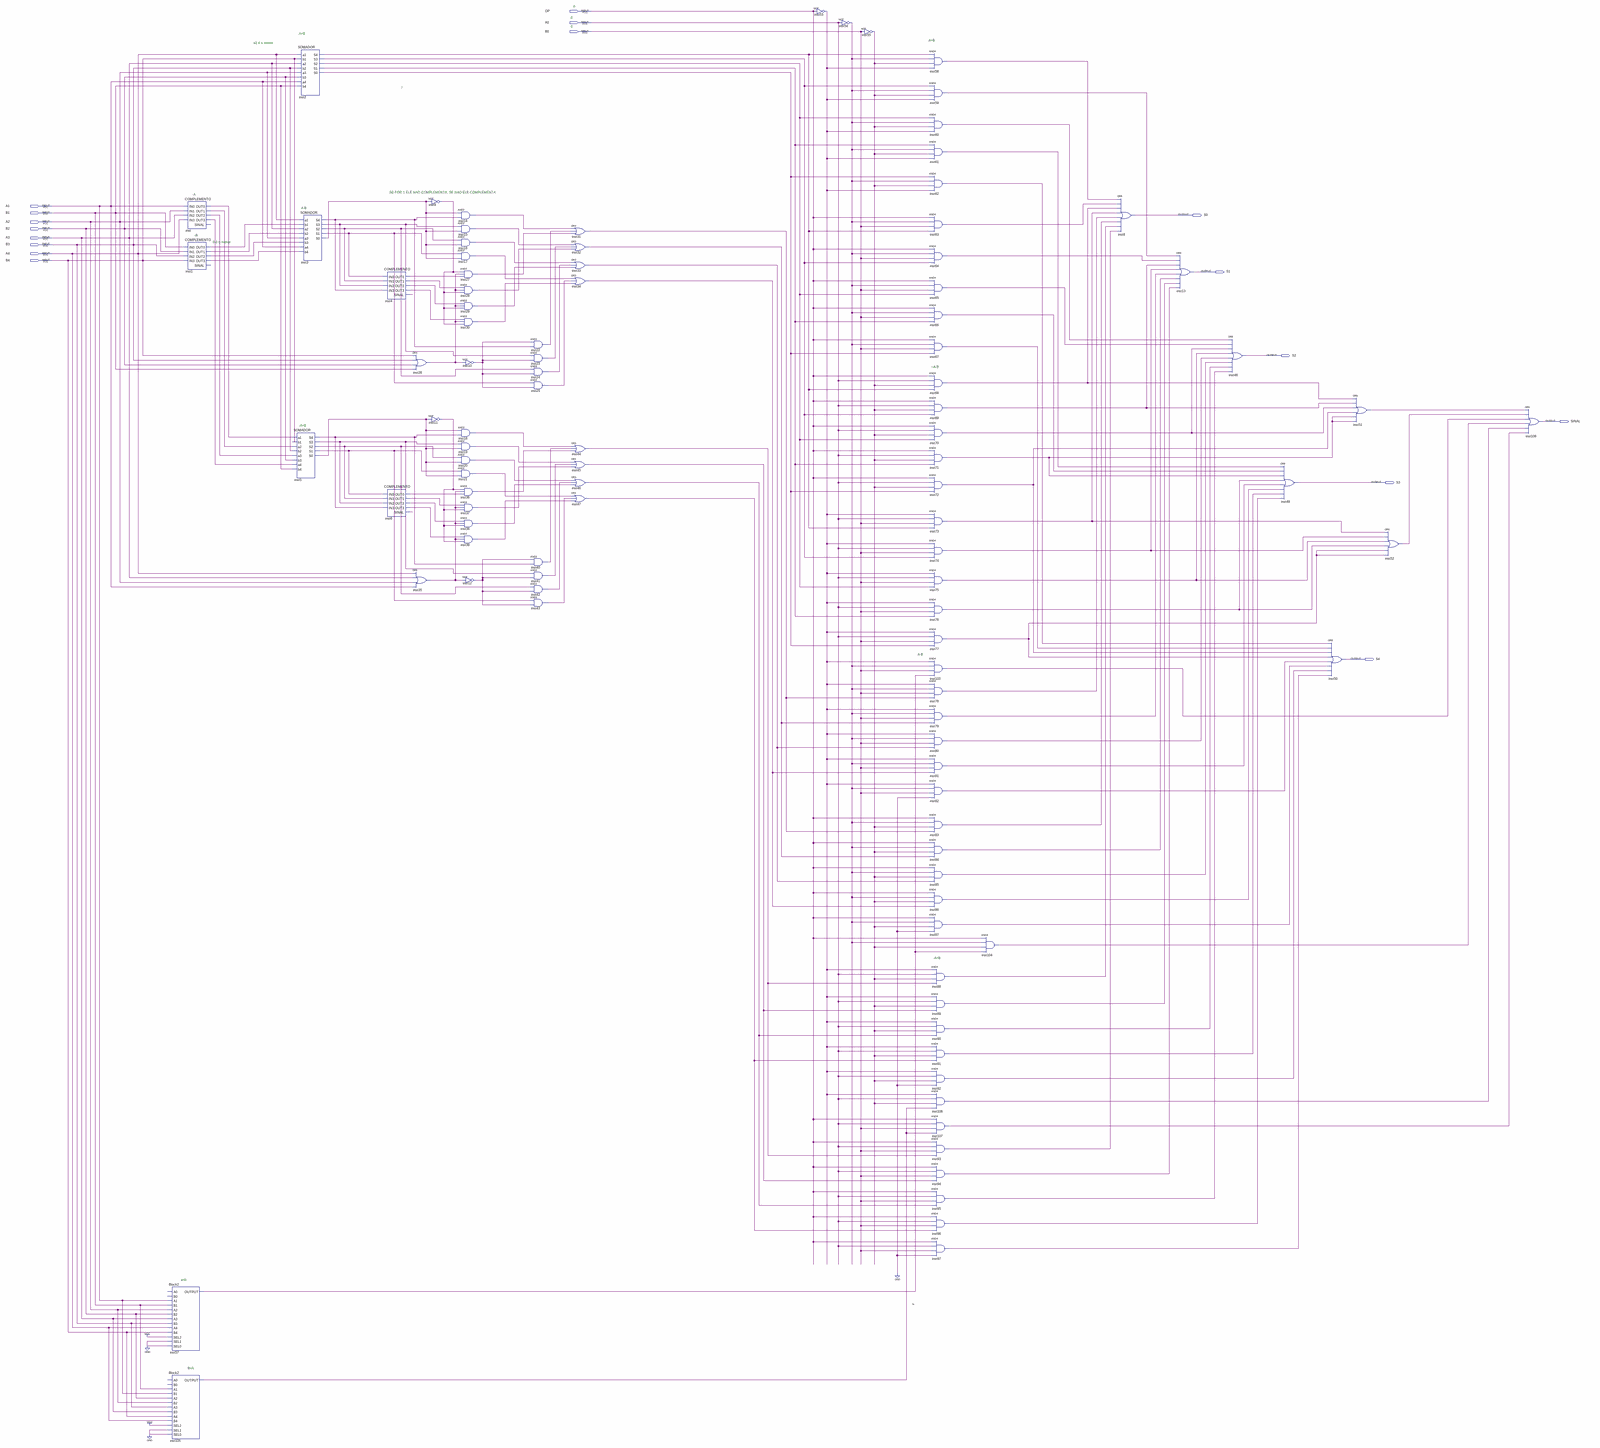
[diagram p0: schematic sheet, whole]
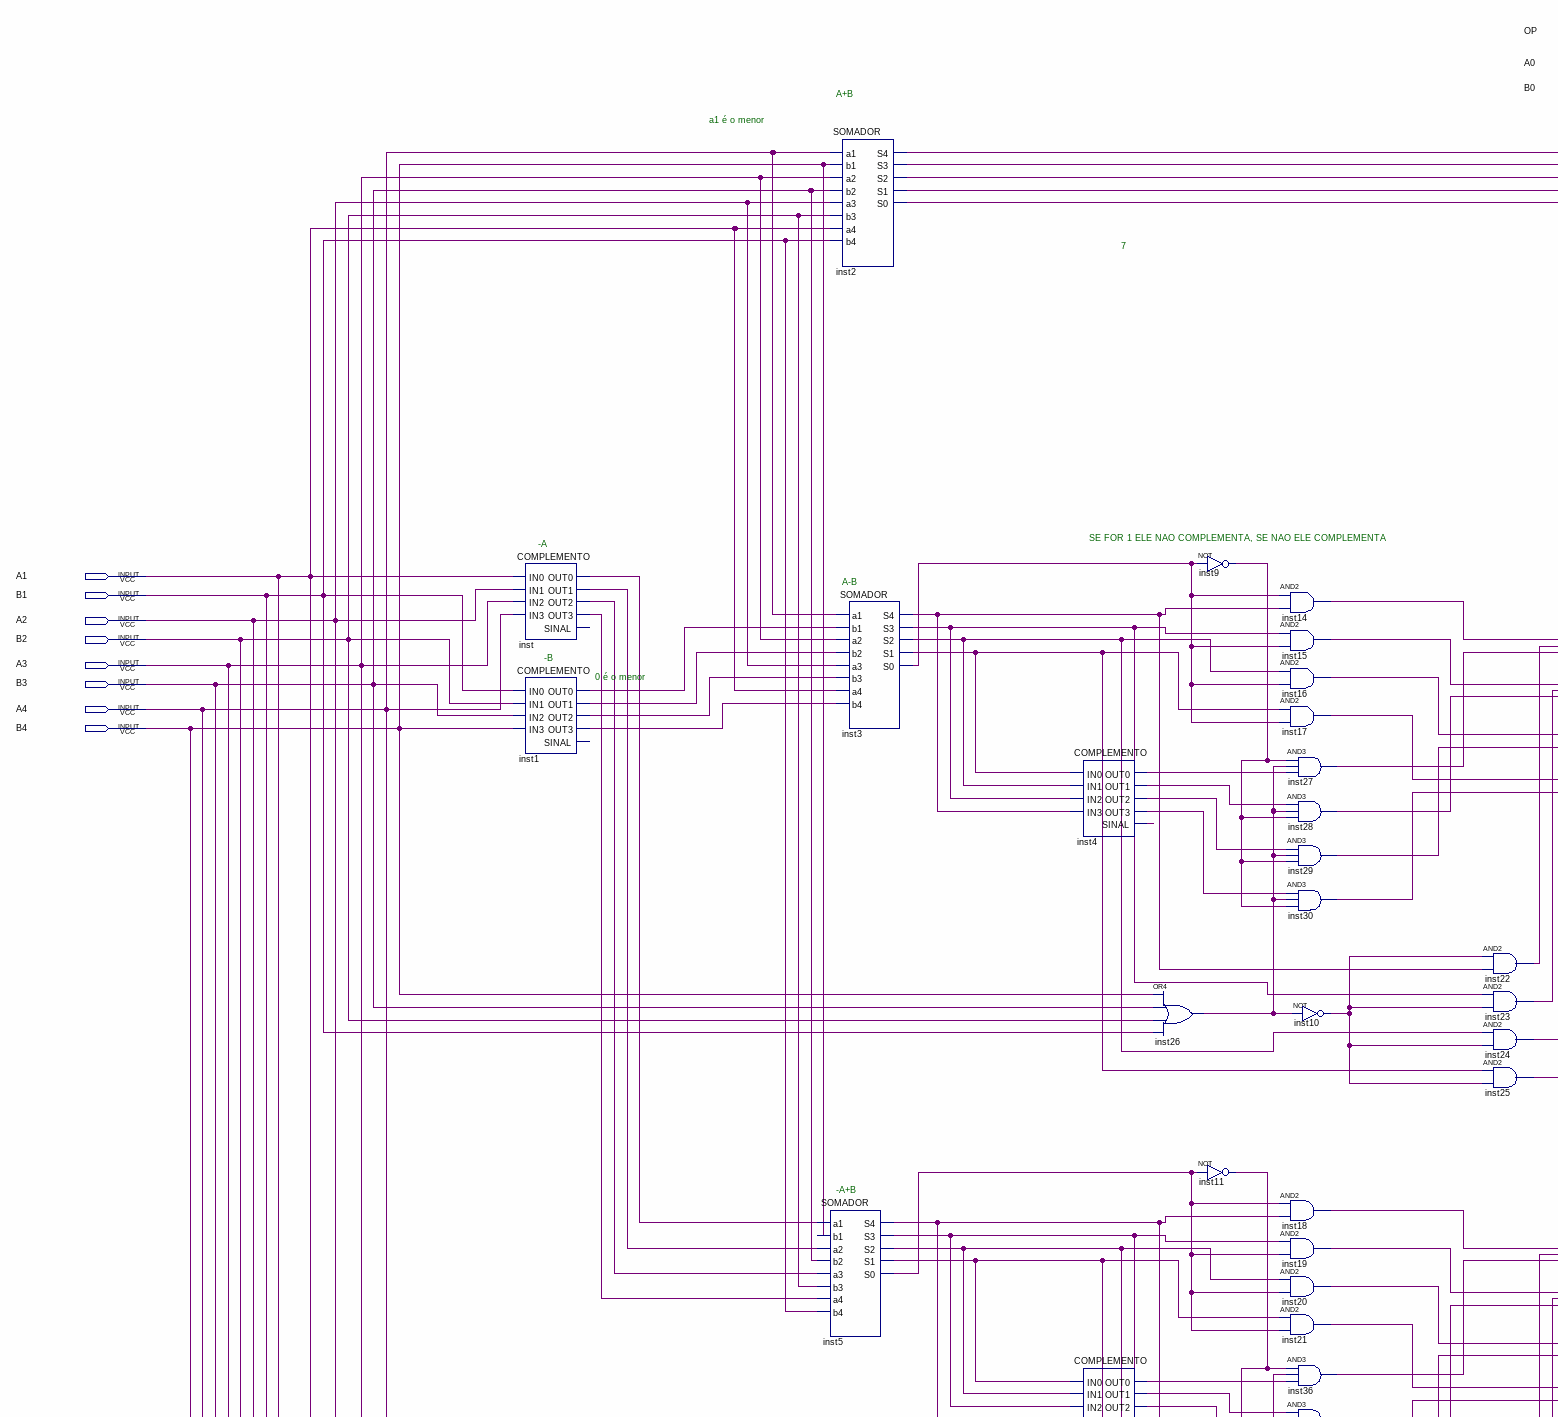
[diagram p1: schematic sheet, upper left part]
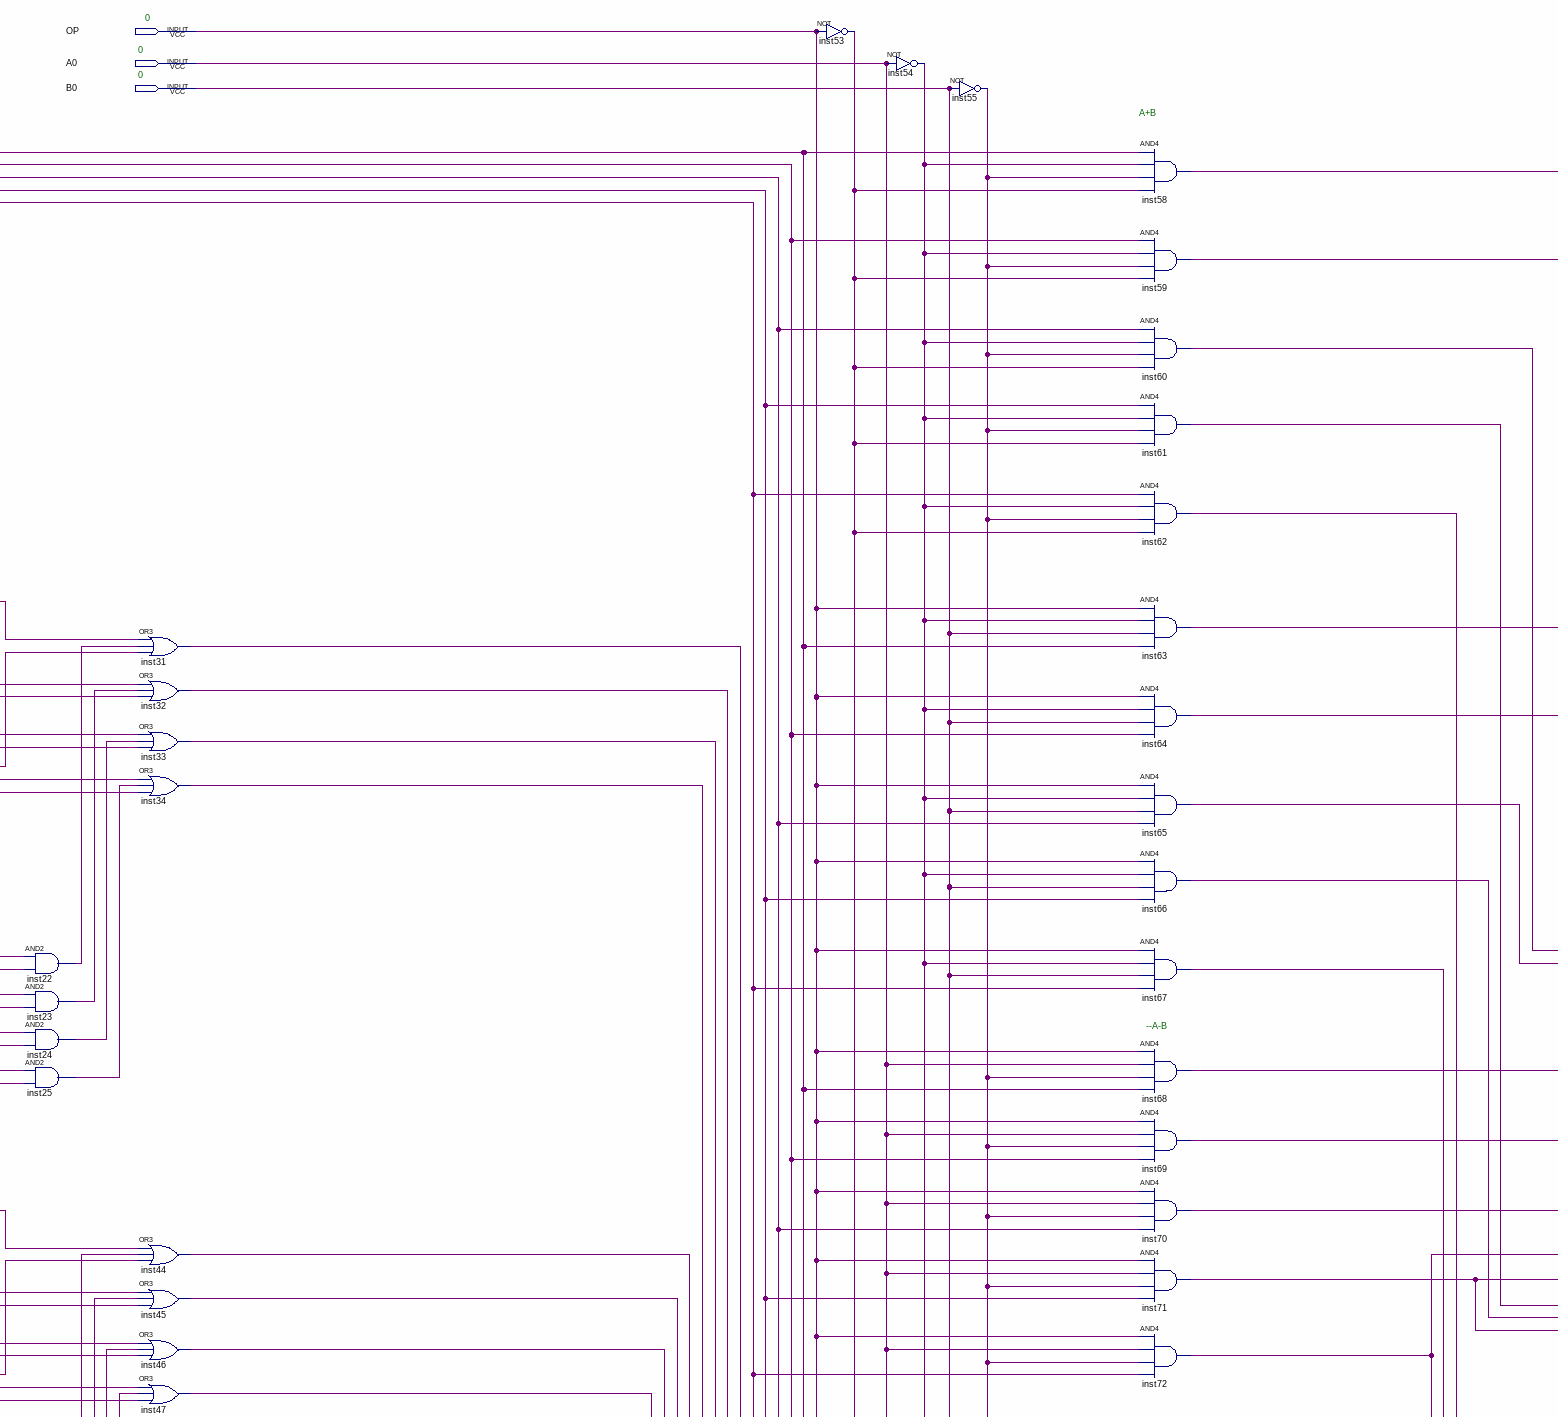
[diagram p2: schematic sheet, upper centre part]
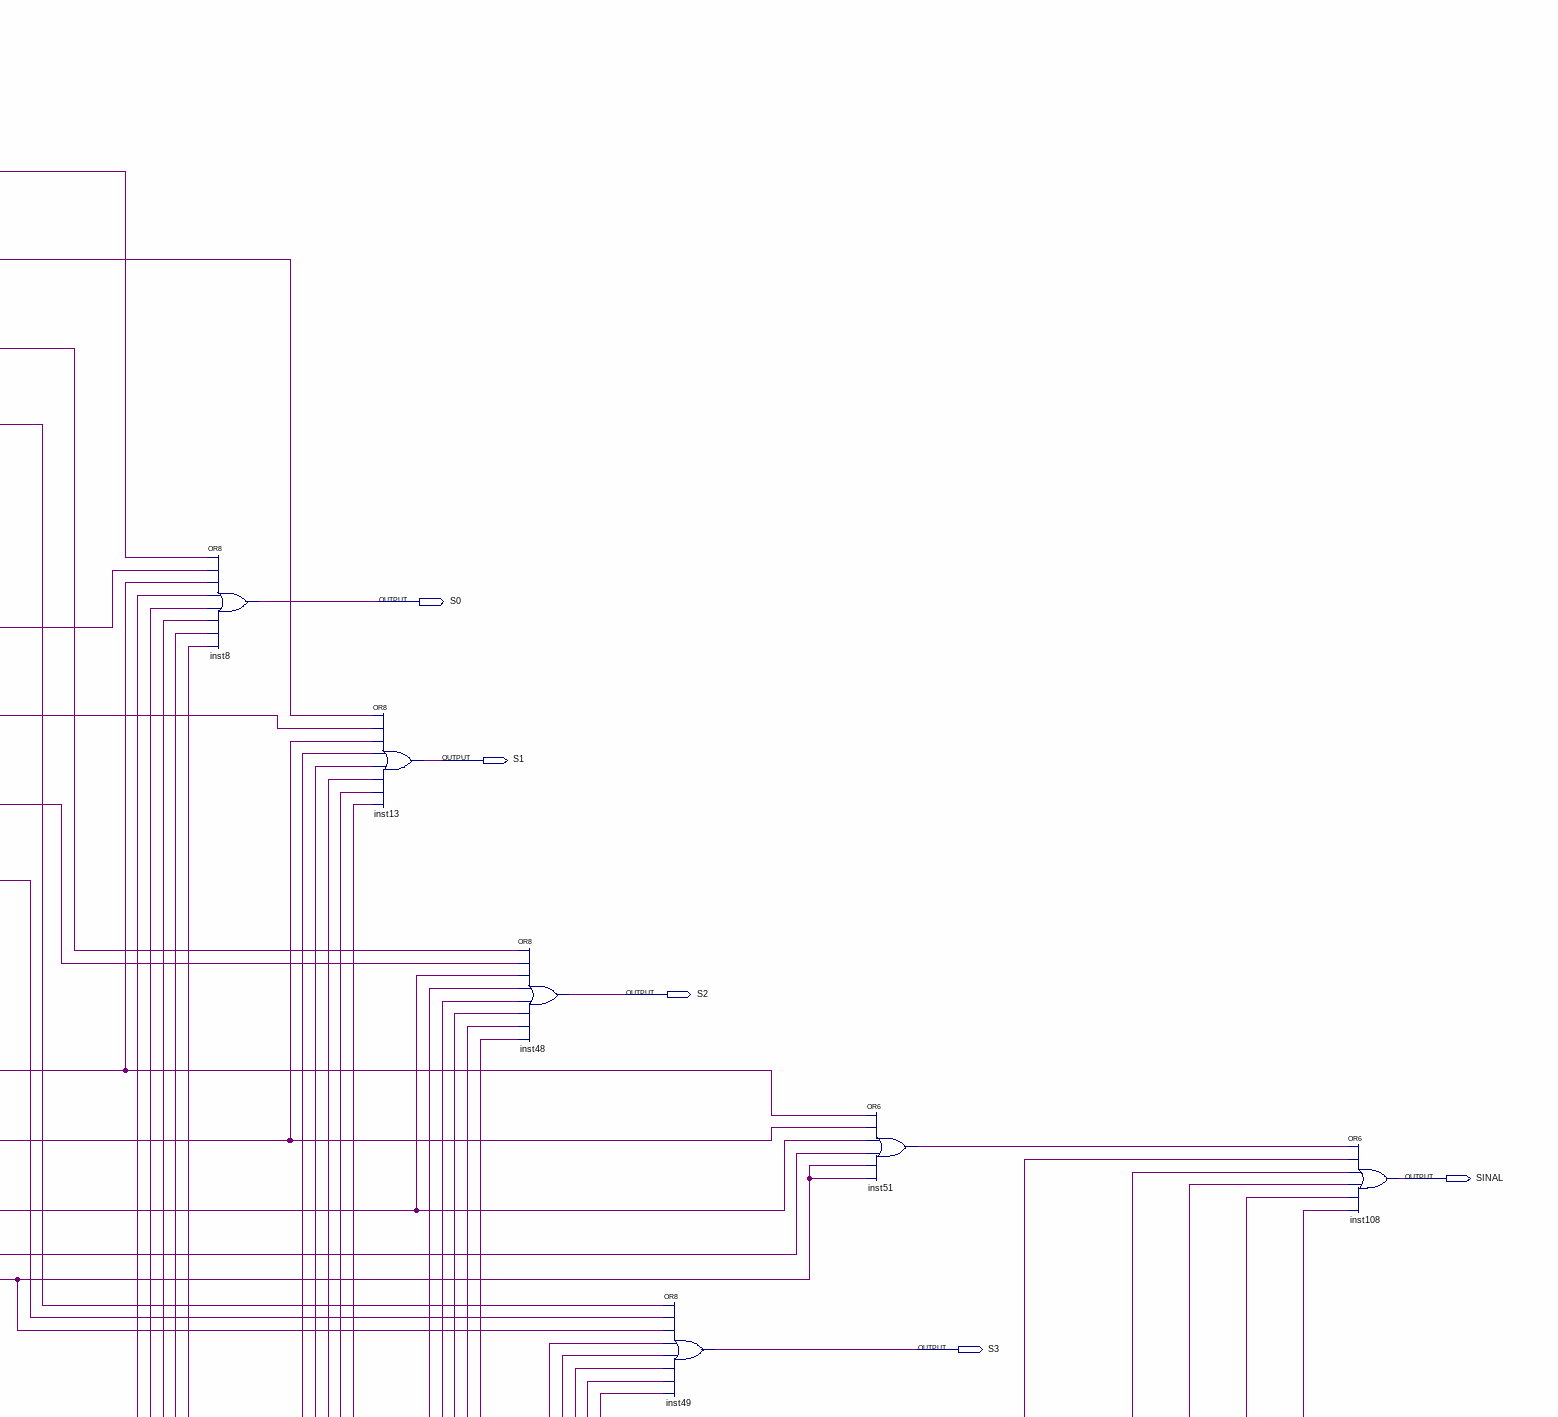
[diagram p3: schematic sheet, upper right part]
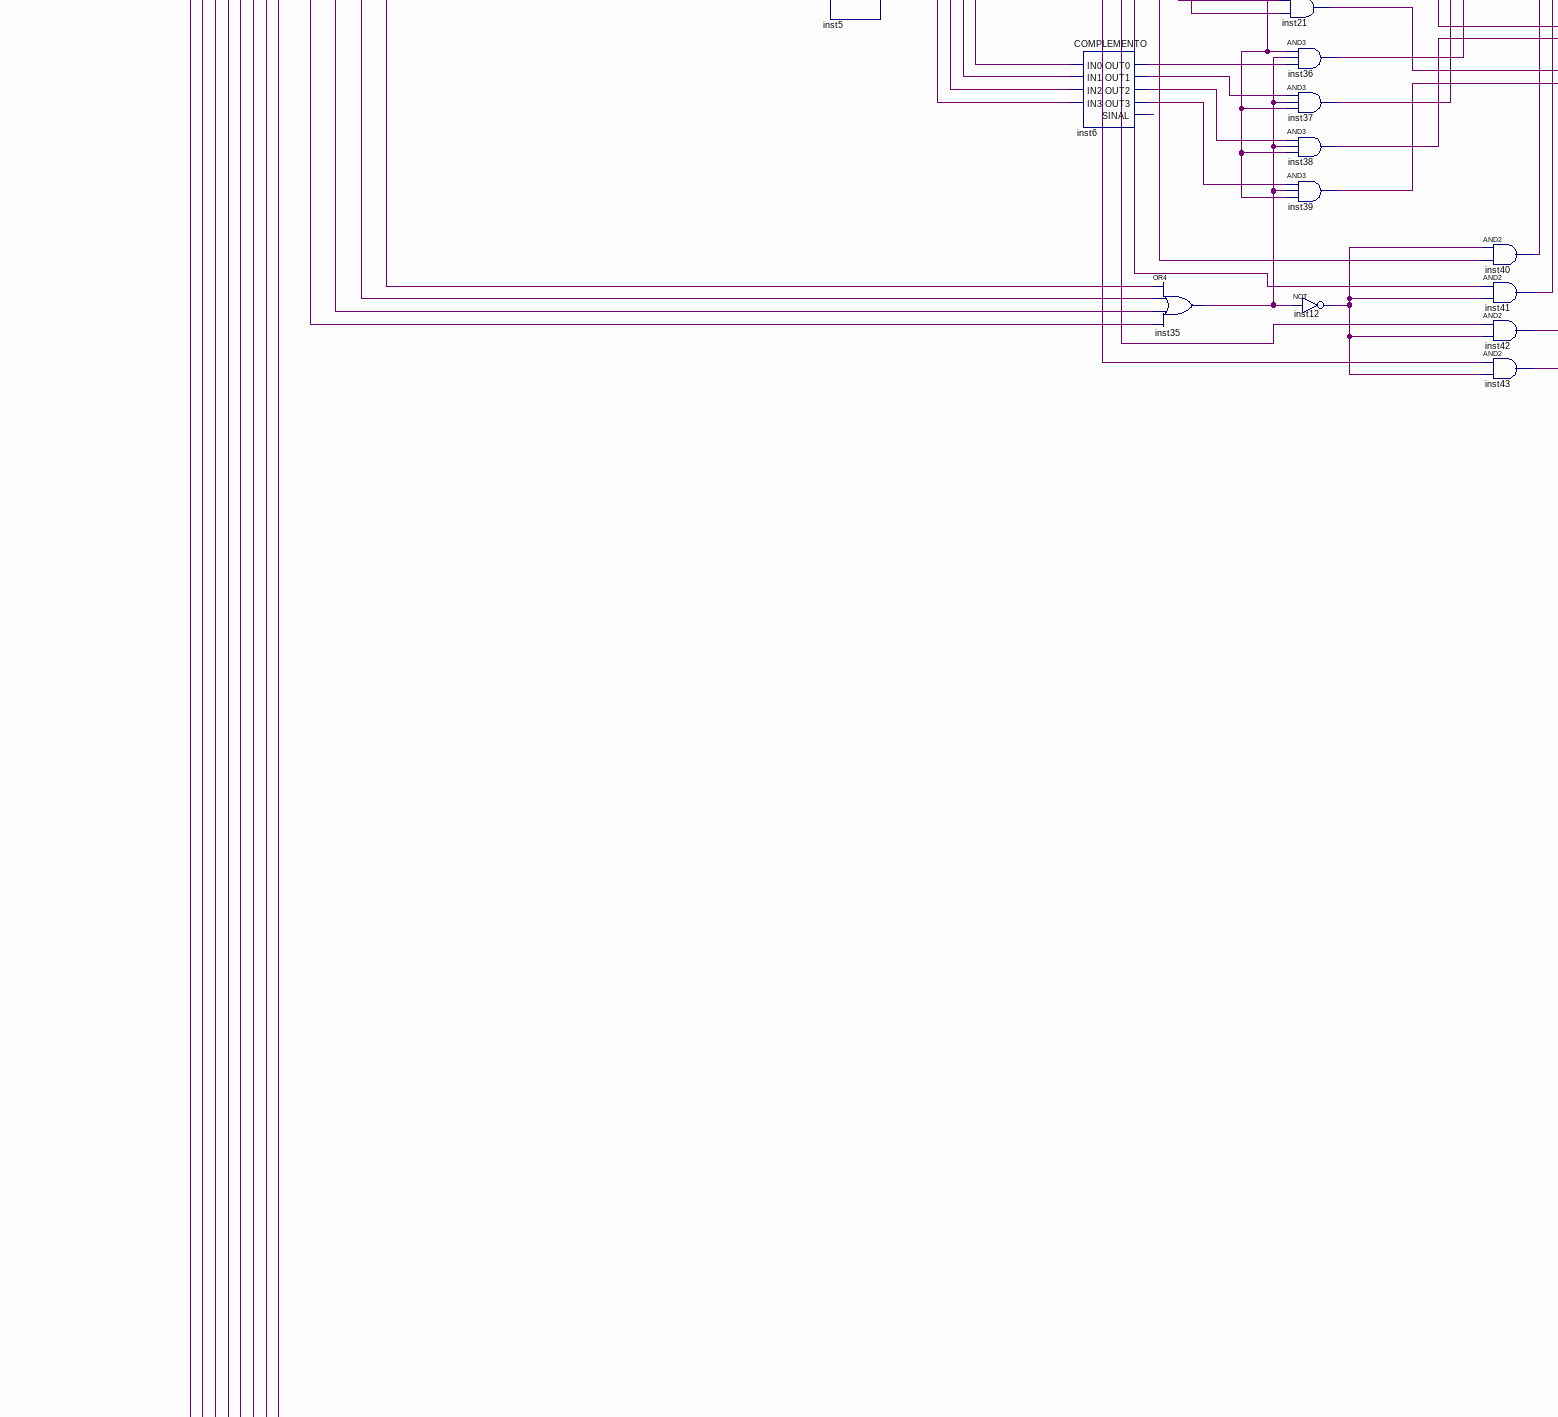
[diagram p4: schematic sheet, middle left part]
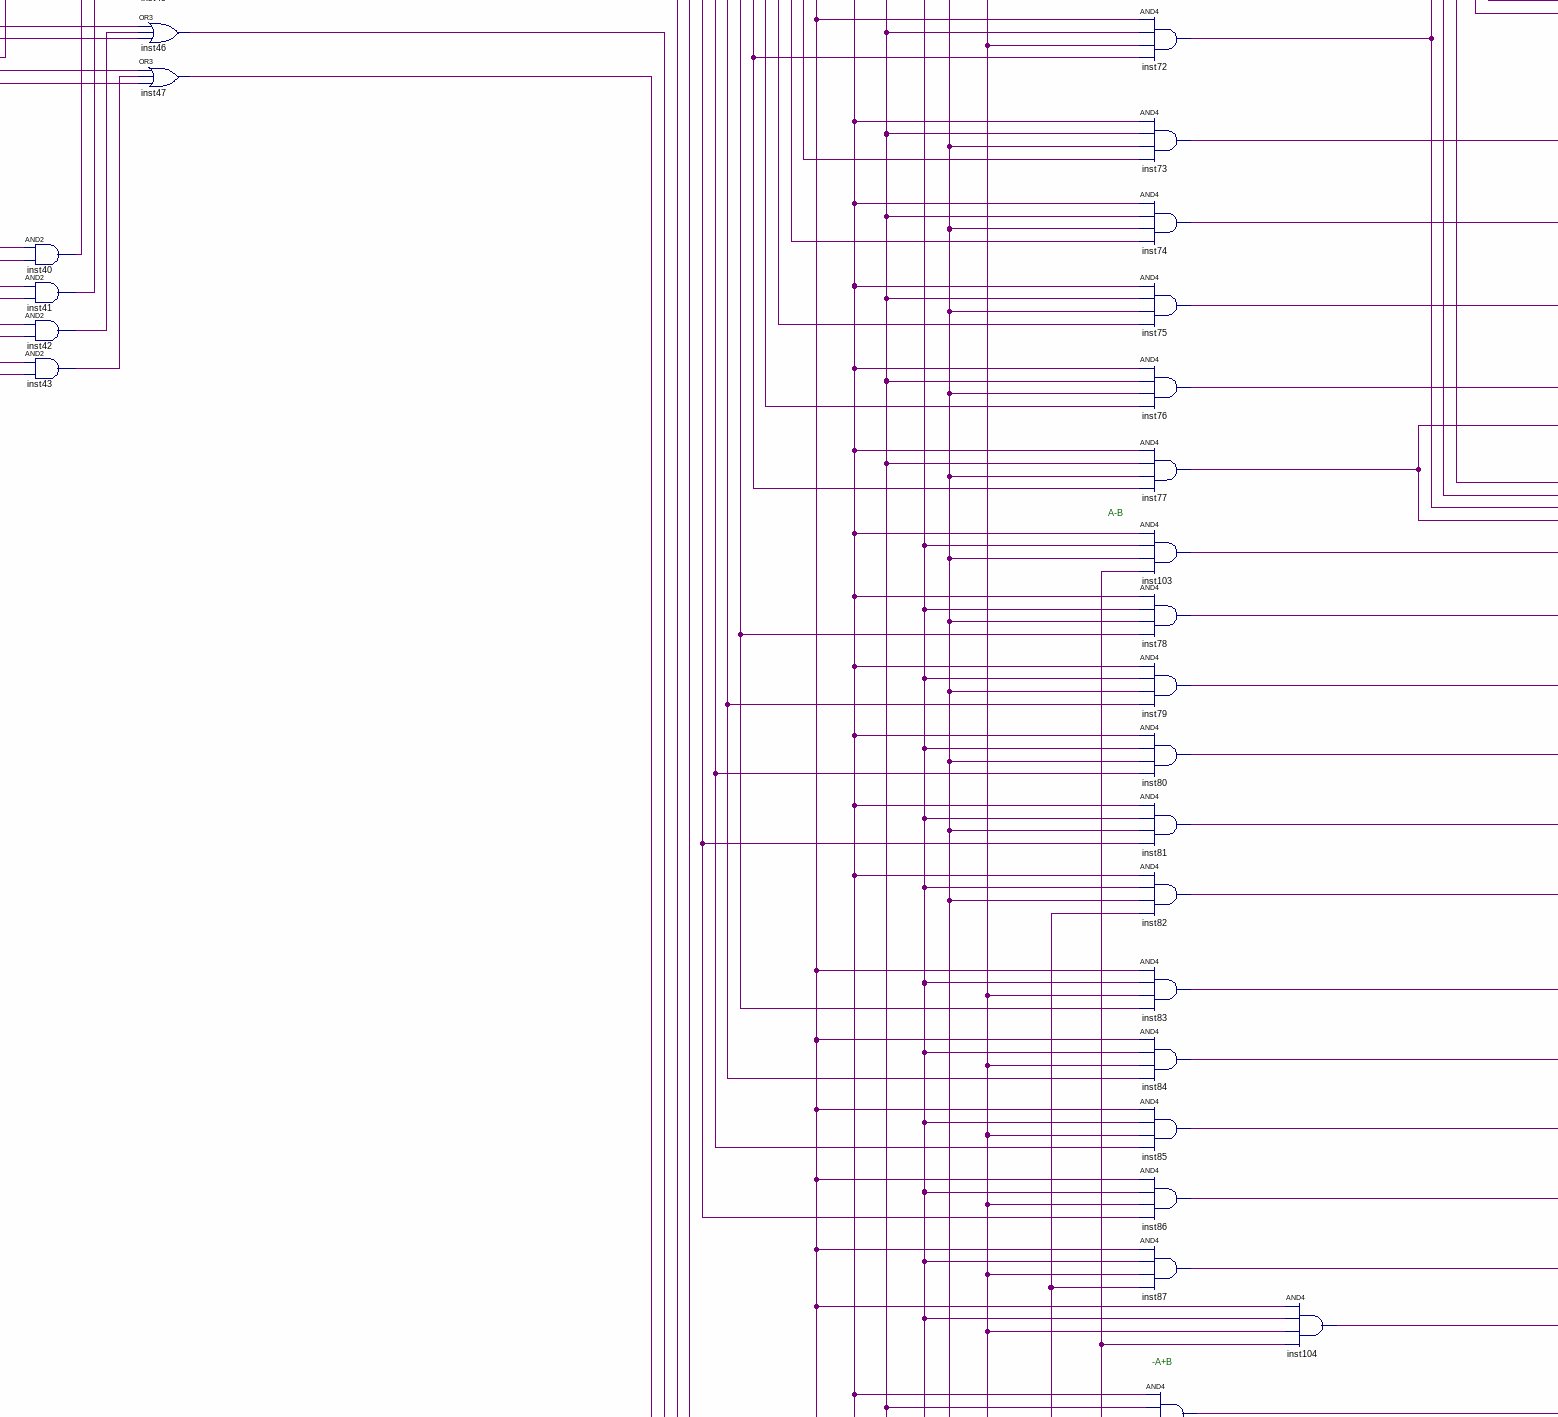
[diagram p5: schematic sheet, middle centre part]
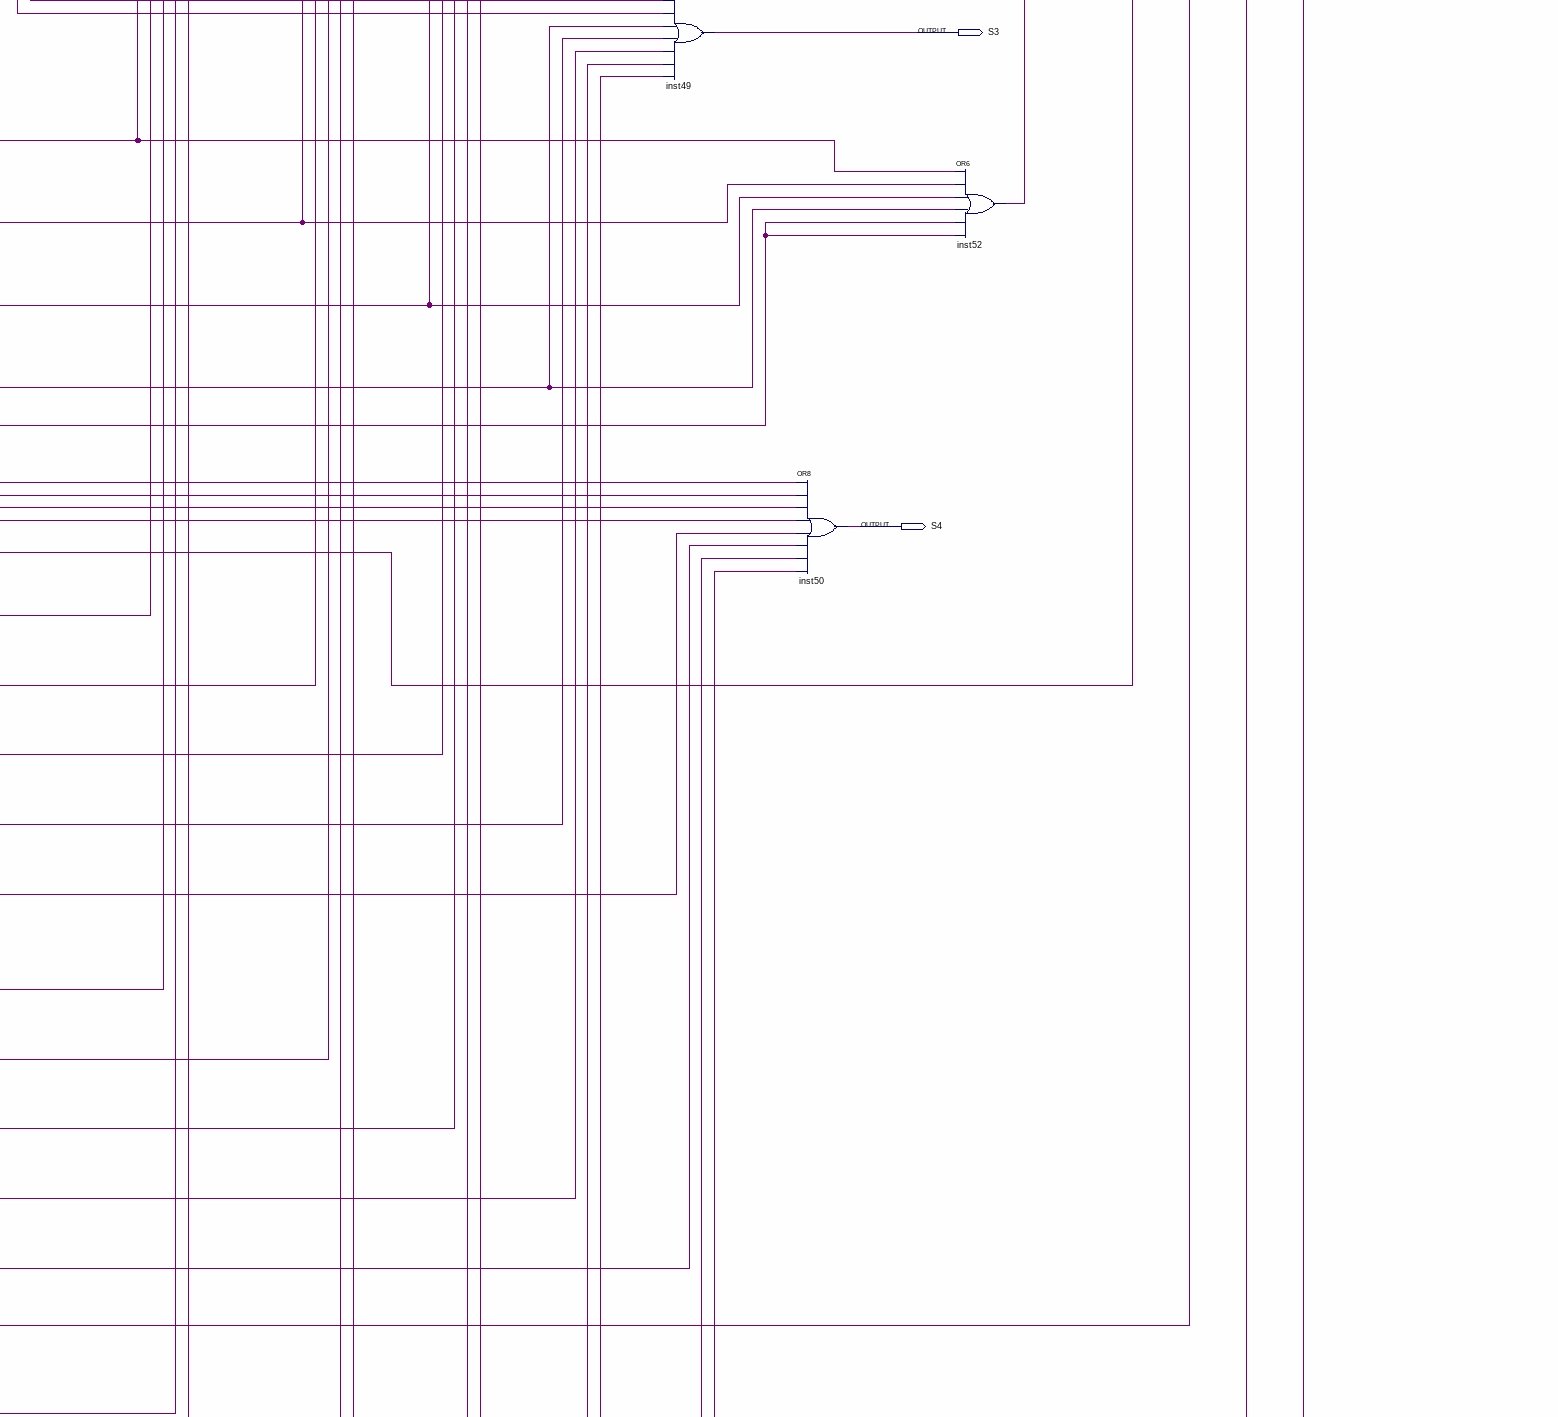
[diagram p6: schematic sheet, middle right part]
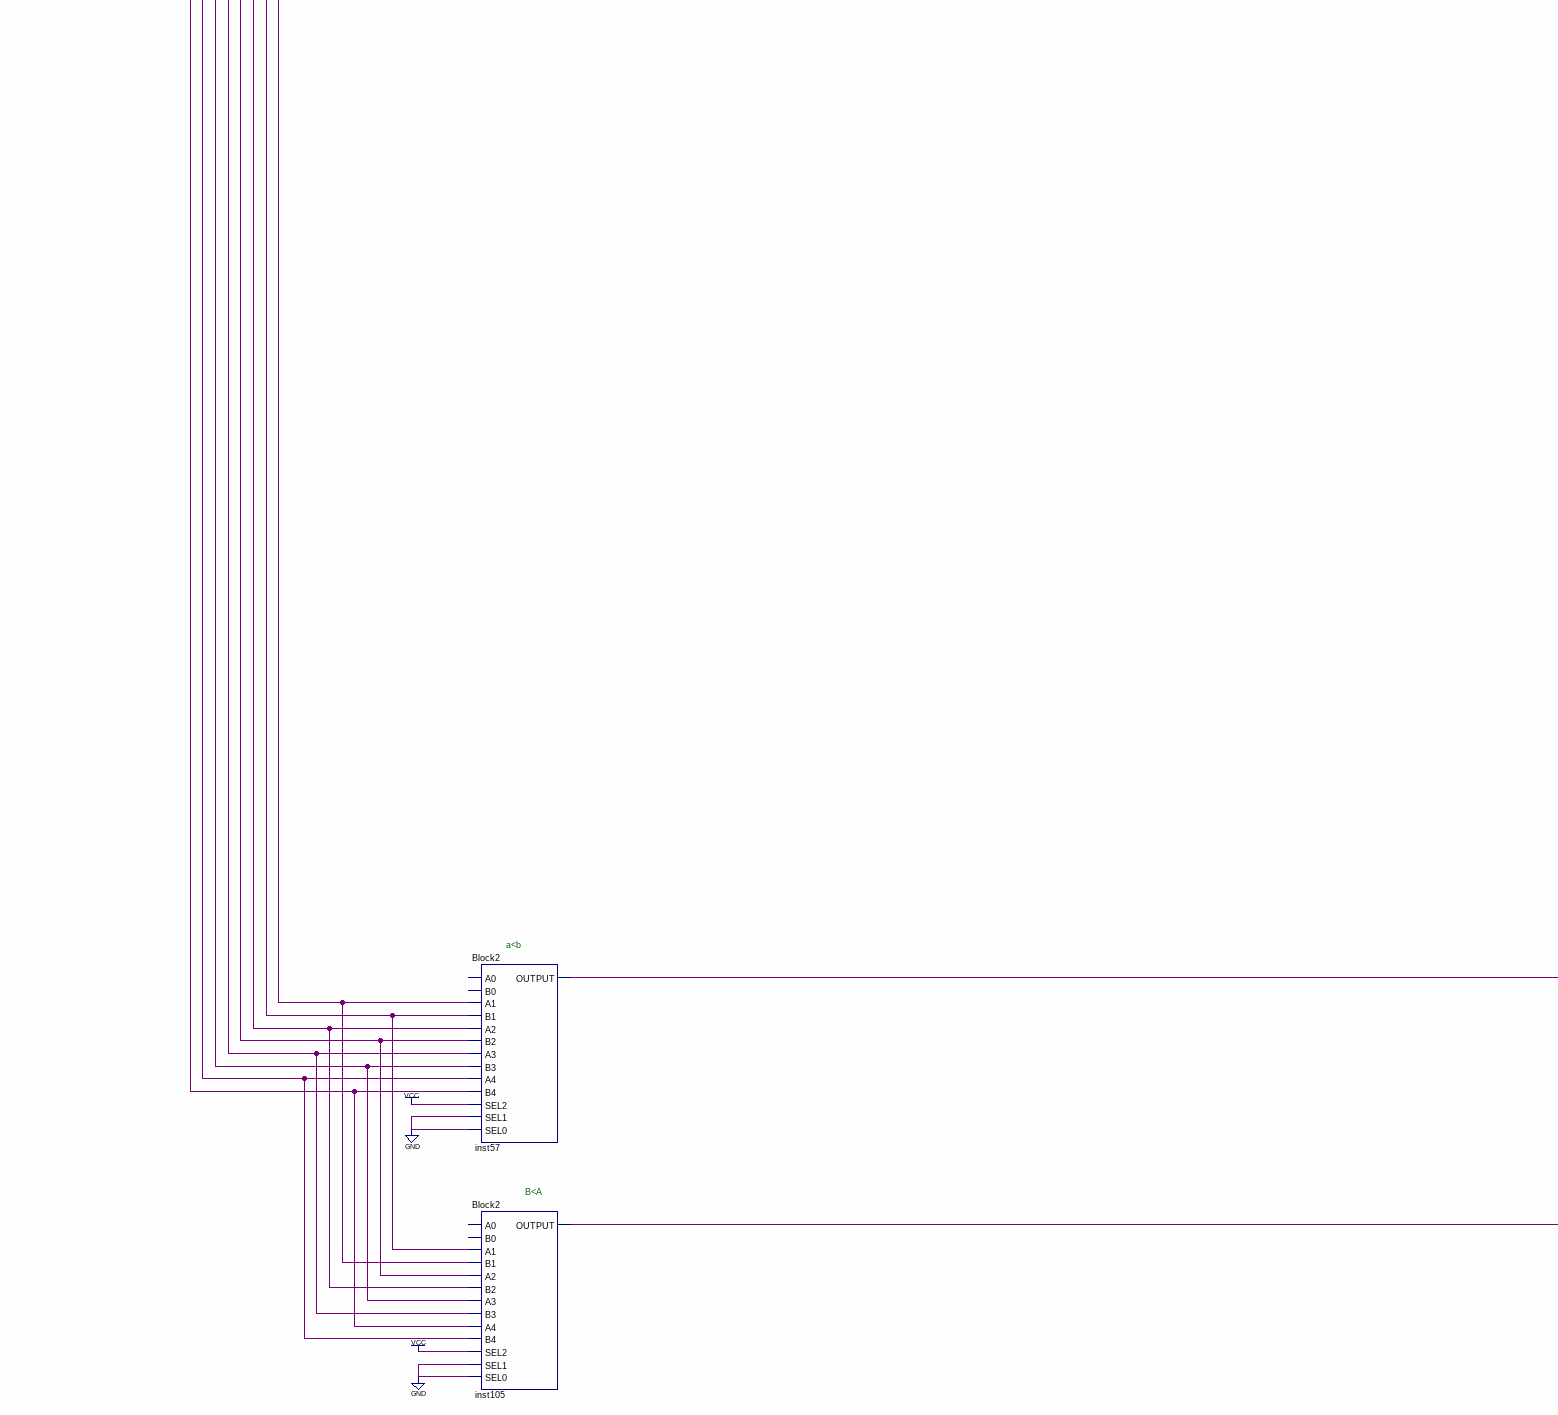
[diagram p7: schematic sheet, lower left part]
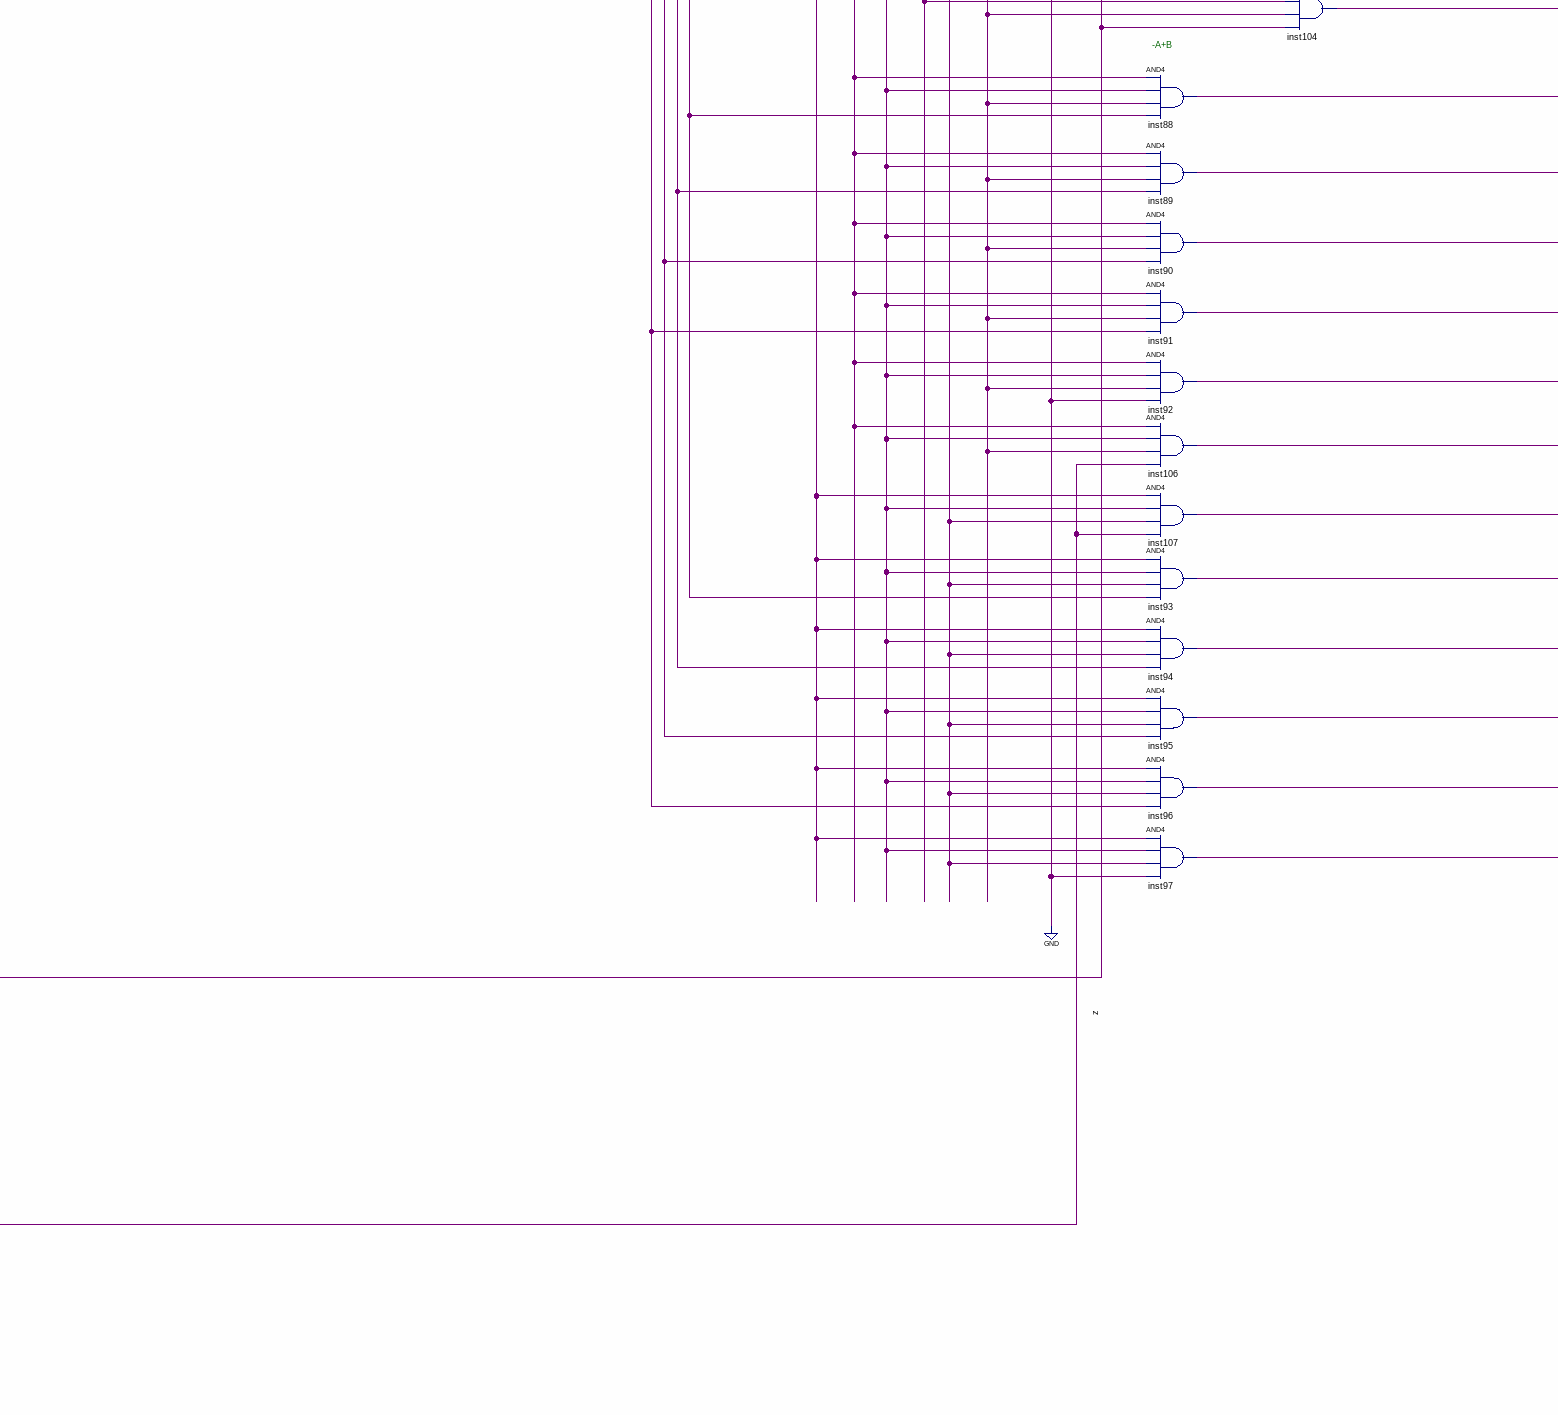
[diagram p8: schematic sheet, lower centre part]
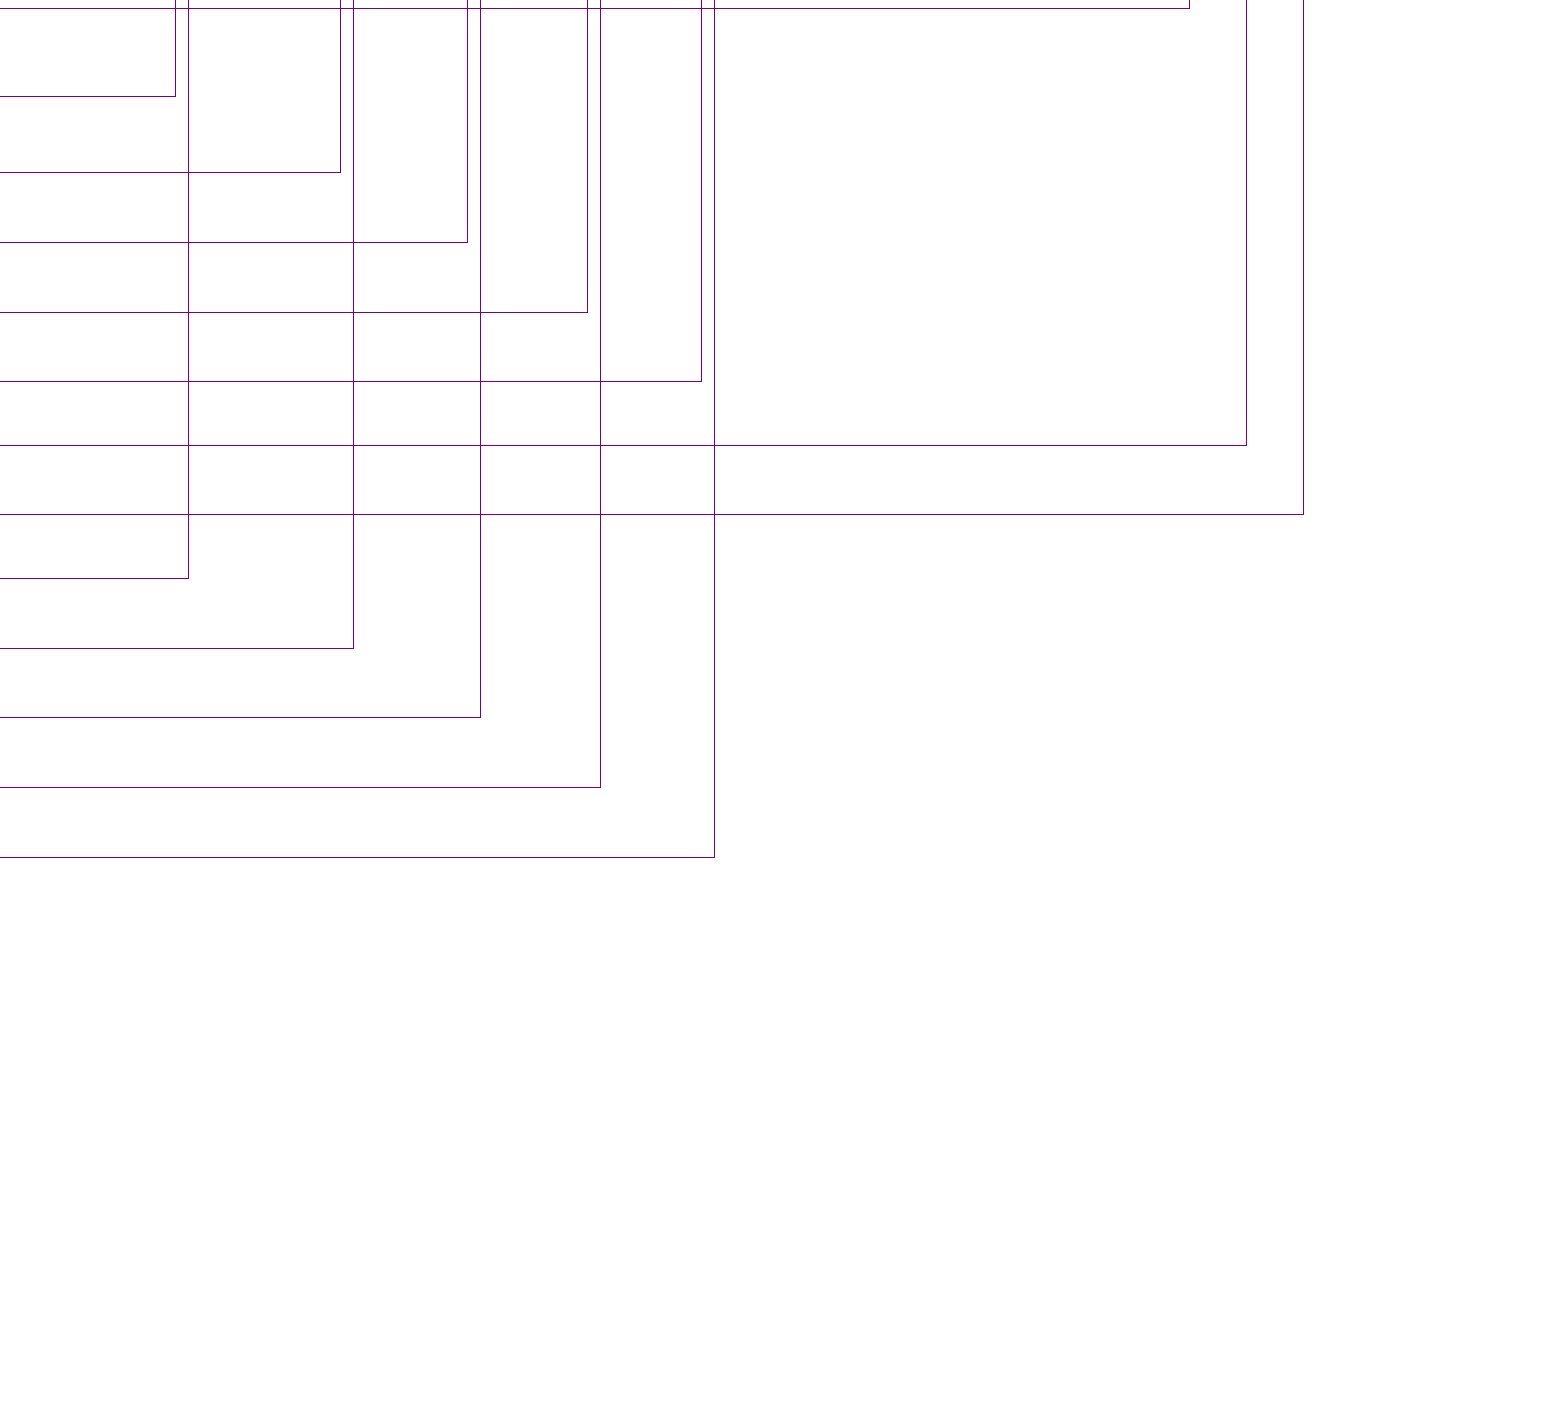
[diagram p9: schematic sheet, lower right part]
// Quartus schematic PROJULA.bdf as structural Verilog: 102 symbols, 17 pins
module PROJULA (
  input  OP,
  input  A0,
  input  B0,
  input  A1,
  input  B1,
  input  A2,
  input  B2,
  input  A3,
  input  B3,
  input  A4,
  input  B4,
  output S0,
  output S1,
  output S2,
  output SINAL,
  output S3,
  output S4
);

  wire inst1_out0, inst1_out1, inst1_out2, inst1_out3, inst2_s0, inst2_s1, inst2_s2, inst2_s3, inst2_s4,
       inst3_s0, inst3_s1, inst3_s2, inst3_s3, inst3_s4, inst4_out0, inst4_out1, inst4_out2, inst4_out3,
       inst4_sinal, inst5_s0, inst5_s1, inst5_s2, inst5_s3, inst5_s4, inst6_out0, inst6_out1, inst6_out2,
       inst6_out3, inst6_sinal, inst9_out, inst10_out, inst11_out, inst12_out, inst14_out, inst15_out,
       inst16_out, inst17_out, inst18_out, inst19_out, inst20_out, inst21_out, inst22_out, inst23_out,
       inst24_out, inst25_out, inst26_out, inst27_out, inst28_out, inst29_out, inst30_out, inst31_out,
       inst32_out, inst33_out, inst34_out, inst35_out, inst36_out, inst37_out, inst38_out, inst39_out,
       inst40_out, inst41_out, inst42_out, inst43_out, inst44_out, inst45_out, inst46_out, inst47_out,
       inst51_out, inst52_out, inst53_out, inst54_out, inst55_out, inst58_out, inst59_out, inst60_out,
       inst61_out, inst62_out, inst63_out, inst64_out, inst65_out, inst66_out, inst67_out, inst68_out,
       inst69_out, inst70_out, inst71_out, inst72_out, inst73_out, inst74_out, inst75_out, inst76_out,
       inst77_out, inst78_out, inst79_out, inst80_out, inst81_out, inst82_out, inst83_out, inst84_out,
       inst85_out, inst86_out, inst87_out, inst88_out, inst89_out, inst90_out, inst91_out, inst92_out,
       inst93_out, inst94_out, inst95_out, inst96_out, inst97_out, inst103_out, inst104_out, inst105_output,
       inst106_out, inst107_out, inst_out0, inst_out1, inst_out2, inst_out3, z;

  COMPLEMENTO inst (
    .IN0(A1), .IN1(A2), .IN2(A3), .IN3(A4), .OUT0(inst_out0), .OUT1(inst_out1), .OUT2(inst_out2),
    .OUT3(inst_out3));  // open: SINAL
  COMPLEMENTO inst1 (
    .IN0(B1), .IN1(B2), .IN2(B3), .IN3(B4), .OUT0(inst1_out0), .OUT1(inst1_out1), .OUT2(inst1_out2),
    .OUT3(inst1_out3));  // open: SINAL
  Block2 inst57 (
    .A1(A1), .B1(B1), .A2(A2), .B2(B2), .A3(A3), .B3(B3), .A4(A4), .B4(B4), .SEL2(1'b1), .SEL1(1'b0),
    .SEL0(1'b0), .OUTPUT(z));  // open: A0, B0
  Block2 inst105 (
    .A1(B1), .B1(A1), .A2(B2), .B2(A2), .A3(B3), .B3(A3), .A4(B4), .B4(A4), .SEL2(1'b1), .SEL1(1'b0),
    .SEL0(1'b0), .OUTPUT(inst105_output));  // open: A0, B0
  SOMADOR inst5 (
    .a1(inst_out0), .b1(B4), .a2(inst_out1), .b2(B3), .a3(inst_out2), .b3(B2), .a4(inst_out3), .b4(B1),
    .S4(inst5_s4), .S3(inst5_s3), .S2(inst5_s2), .S1(inst5_s1), .S0(inst5_s0));
  SOMADOR inst2 (
    .a1(A4), .b1(B4), .a2(A3), .b2(B3), .a3(A2), .b3(B2), .a4(A1), .b4(B1), .S4(inst2_s4), .S3(inst2_s3),
    .S2(inst2_s2), .S1(inst2_s1), .S0(inst2_s0));
  SOMADOR inst3 (
    .a1(A4), .b1(inst1_out0), .a2(A3), .b2(inst1_out1), .a3(A2), .b3(inst1_out2), .a4(A1), .b4(inst1_out3),
    .S4(inst3_s4), .S3(inst3_s3), .S2(inst3_s2), .S1(inst3_s1), .S0(inst3_s0));
  COMPLEMENTO inst4 (
    .IN0(inst3_s1), .IN1(inst3_s2), .IN2(inst3_s3), .IN3(inst3_s4), .OUT0(inst4_out0), .OUT1(inst4_out1),
    .OUT2(inst4_out2), .OUT3(inst4_out3), .SINAL(inst4_sinal));
  COMPLEMENTO inst6 (
    .IN0(inst5_s1), .IN1(inst5_s2), .IN2(inst5_s3), .IN3(inst5_s4), .OUT0(inst6_out0), .OUT1(inst6_out1),
    .OUT2(inst6_out2), .OUT3(inst6_out3), .SINAL(inst6_sinal));
  or inst26 (inst26_out, B4, B3, B2, B1);
  or inst35 (inst35_out, A4, A3, A2, A1);
  not inst9 (inst9_out, inst3_s0);
  not inst11 (inst11_out, inst5_s0);
  and inst14 (inst14_out, inst3_s0, inst3_s4);
  and inst15 (inst15_out, inst3_s3, inst3_s0);
  and inst16 (inst16_out, inst3_s2, inst3_s0);
  and inst17 (inst17_out, inst3_s1, inst3_s0);
  and inst27 (inst27_out, inst9_out, inst26_out, inst4_out0);
  and inst28 (inst28_out, inst4_out1, inst26_out, inst9_out);
  and inst29 (inst29_out, inst4_out2, inst26_out, inst9_out);
  and inst30 (inst30_out, inst4_out3, inst26_out, inst9_out);
  not inst10 (inst10_out, inst26_out);
  and inst18 (inst18_out, inst5_s0, inst5_s4);
  and inst19 (inst19_out, inst5_s3, inst5_s0);
  and inst20 (inst20_out, inst5_s2, inst5_s0);
  and inst21 (inst21_out, inst5_s1, inst5_s0);
  and inst36 (inst36_out, inst11_out, inst35_out, inst6_out0);
  and inst37 (inst37_out, inst6_out1, inst35_out, inst11_out);
  and inst38 (inst38_out, inst6_out2, inst35_out, inst11_out);
  and inst39 (inst39_out, inst6_out3, inst35_out, inst11_out);
  not inst12 (inst12_out, inst35_out);
  and inst22 (inst22_out, inst10_out, inst3_s4);
  and inst23 (inst23_out, inst3_s3, inst10_out);
  and inst24 (inst24_out, inst3_s2, inst10_out);
  and inst25 (inst25_out, inst3_s1, inst10_out);
  and inst40 (inst40_out, inst12_out, inst5_s4);
  and inst41 (inst41_out, inst5_s3, inst12_out);
  and inst42 (inst42_out, inst5_s2, inst12_out);
  and inst43 (inst43_out, inst5_s1, inst12_out);
  or inst31 (inst31_out, inst14_out, inst22_out, inst27_out);
  or inst32 (inst32_out, inst15_out, inst23_out, inst28_out);
  or inst33 (inst33_out, inst16_out, inst24_out, inst29_out);
  or inst34 (inst34_out, inst17_out, inst25_out, inst30_out);
  or inst44 (inst44_out, inst18_out, inst40_out, inst36_out);
  or inst45 (inst45_out, inst19_out, inst41_out, inst37_out);
  or inst46 (inst46_out, inst20_out, inst42_out, inst38_out);
  or inst47 (inst47_out, inst21_out, inst43_out, inst39_out);
  not inst53 (inst53_out, OP);
  not inst54 (inst54_out, A0);
  not inst55 (inst55_out, B0);
  and inst58 (inst58_out, inst2_s4, inst54_out, inst55_out, inst53_out);
  and inst59 (inst59_out, inst2_s3, inst54_out, inst55_out, inst53_out);
  and inst60 (inst60_out, inst2_s2, inst54_out, inst55_out, inst53_out);
  and inst61 (inst61_out, inst2_s1, inst54_out, inst55_out, inst53_out);
  and inst62 (inst62_out, inst2_s0, inst54_out, inst55_out, inst53_out);
  and inst63 (inst63_out, OP, inst54_out, B0, inst2_s4);
  and inst64 (inst64_out, OP, inst54_out, B0, inst2_s3);
  and inst65 (inst65_out, OP, inst54_out, B0, inst2_s2);
  and inst66 (inst66_out, OP, inst54_out, B0, inst2_s1);
  and inst67 (inst67_out, OP, inst54_out, B0, inst2_s0);
  and inst68 (inst68_out, OP, A0, inst55_out, inst2_s4);
  and inst69 (inst69_out, OP, A0, inst55_out, inst2_s3);
  and inst70 (inst70_out, OP, A0, inst55_out, inst2_s2);
  and inst71 (inst71_out, OP, A0, inst55_out, inst2_s1);
  and inst72 (inst72_out, OP, A0, inst55_out, inst2_s0);
  and inst73 (inst73_out, inst53_out, A0, B0, inst2_s4);
  and inst74 (inst74_out, inst53_out, A0, B0, inst2_s3);
  and inst75 (inst75_out, inst53_out, A0, B0, inst2_s2);
  and inst76 (inst76_out, inst53_out, A0, B0, inst2_s1);
  and inst77 (inst77_out, inst53_out, A0, B0, inst2_s0);
  and inst103 (inst103_out, inst53_out, inst54_out, B0, z);
  and inst78 (inst78_out, inst53_out, inst54_out, B0, inst31_out);
  and inst79 (inst79_out, inst53_out, inst54_out, B0, inst32_out);
  and inst80 (inst80_out, inst53_out, inst54_out, B0, inst33_out);
  and inst81 (inst81_out, inst53_out, inst54_out, B0, inst34_out);
  and inst82 (inst82_out, inst53_out, inst54_out, B0, 1'b0);
  and inst83 (inst83_out, OP, inst54_out, inst55_out, inst31_out);
  and inst84 (inst84_out, OP, inst54_out, inst55_out, inst32_out);
  and inst85 (inst85_out, OP, inst54_out, inst55_out, inst33_out);
  and inst86 (inst86_out, OP, inst54_out, inst55_out, inst34_out);
  and inst87 (inst87_out, OP, inst54_out, inst55_out, 1'b0);
  and inst88 (inst88_out, inst53_out, A0, inst55_out, inst44_out);
  and inst89 (inst89_out, inst53_out, A0, inst55_out, inst45_out);
  and inst90 (inst90_out, inst53_out, A0, inst55_out, inst46_out);
  and inst91 (inst91_out, inst53_out, A0, inst55_out, inst47_out);
  and inst92 (inst92_out, inst53_out, A0, inst55_out, 1'b0);
  and inst106 (inst106_out, inst53_out, A0, inst55_out, inst105_output);
  and inst107 (inst107_out, OP, A0, B0, inst105_output);
  and inst93 (inst93_out, OP, A0, B0, inst44_out);
  and inst94 (inst94_out, OP, A0, B0, inst45_out);
  and inst95 (inst95_out, OP, A0, B0, inst46_out);
  and inst96 (inst96_out, OP, A0, B0, inst47_out);
  and inst97 (inst97_out, OP, A0, B0, 1'b0);
  and inst104 (inst104_out, OP, inst54_out, inst55_out, z);
  or inst8 (S0, inst58_out, inst63_out, inst68_out, inst73_out, inst78_out, inst83_out, inst88_out, inst93_out);
  or inst13 (S1, inst59_out, inst64_out, inst69_out, inst74_out, inst79_out, inst84_out, inst89_out, inst94_out);
  or inst48 (S2, inst60_out, inst65_out, inst70_out, inst75_out, inst80_out, inst85_out, inst90_out, inst95_out);
  or inst49 (S3, inst61_out, inst66_out, inst71_out, inst76_out, inst81_out, inst86_out, inst91_out, inst96_out);
  or inst50 (S4, inst62_out, inst67_out, inst72_out, inst77_out, inst82_out, inst87_out, inst92_out, inst97_out);
  or inst51 (inst51_out, inst68_out, inst69_out, inst70_out, inst72_out, inst71_out, inst71_out);
  or inst52 (inst52_out, inst73_out, inst74_out, inst75_out, inst76_out, inst77_out, inst77_out);
  or inst108 (SINAL, inst51_out, inst52_out, inst103_out, inst104_out, inst106_out, inst107_out);

  // Notes on the sheet:
  //   0
  //   0
  //   0
  //   A+B
  //   A+B
  //   a1 é o menor
  //   7
  //   SE FOR 1 ELE NAO COMPLEMENTA, SE NAO ELE COMPLEMENTA
  //   -A
  //   A-B
  //   -B
  //   0 é o menor
  //   --A-B
  //   -A+B
  //   A-B
  //   -A+B
  //   a<b
  //   B<A
endmodule
